# Altium project projet_pcb_etu.PrjPCB
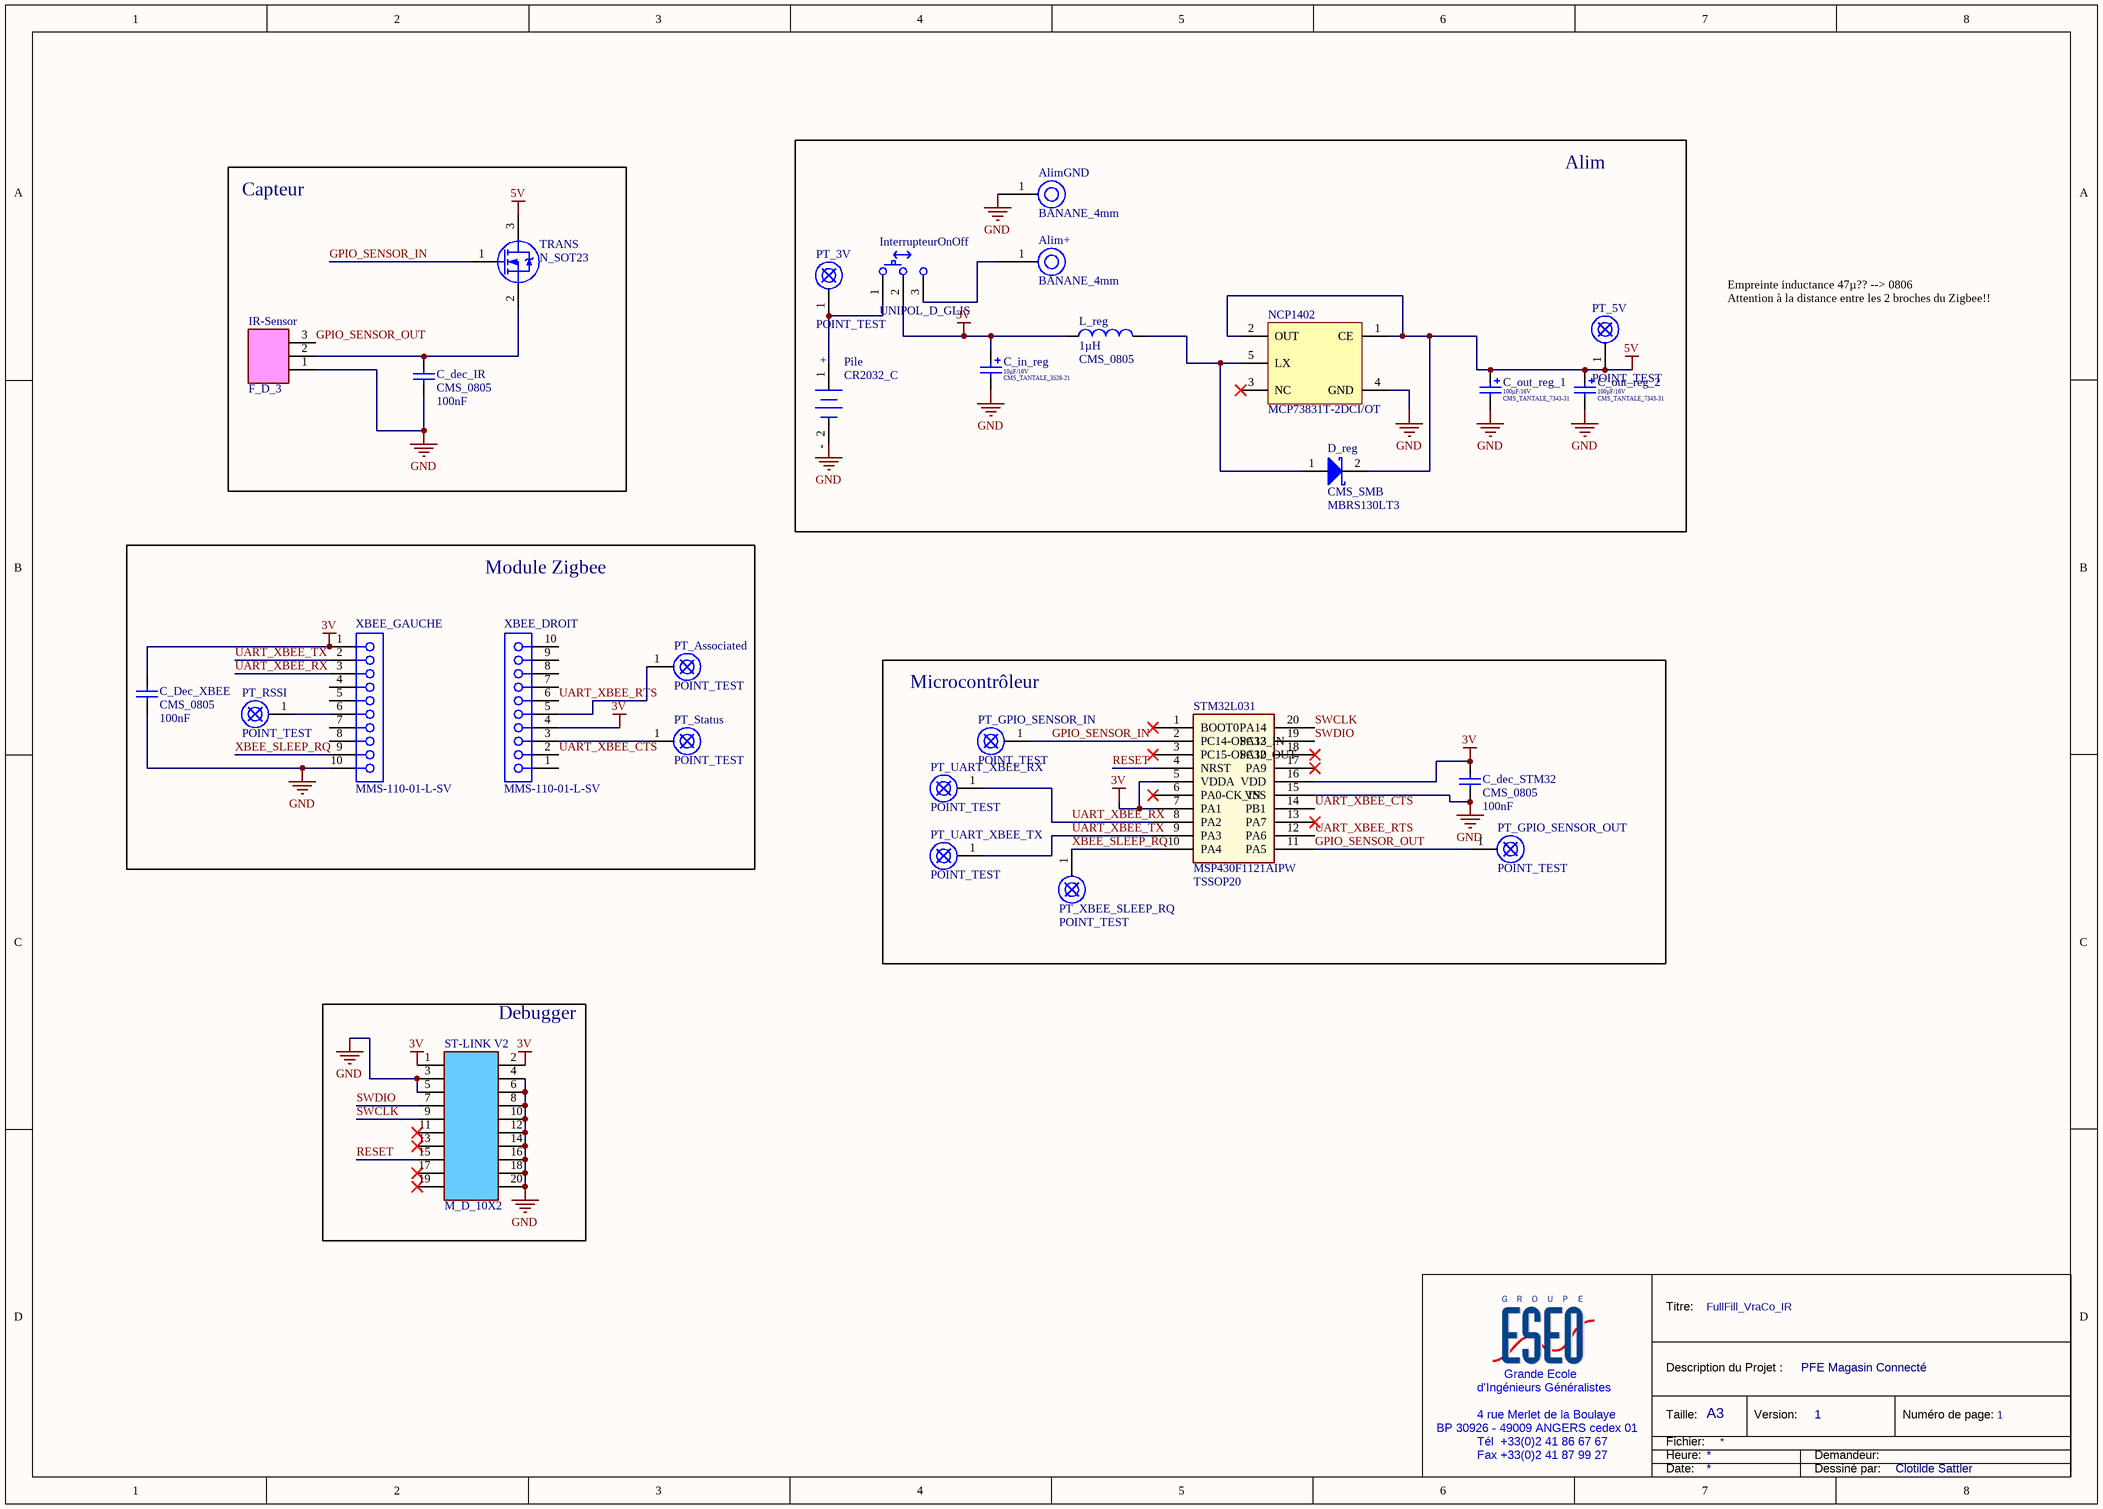
[diagram p0: projet_pcb_etu_formatA3.SchDoc]
1 sheet, 29 parts. Net scope: global (net labels, ports and power ports of the same name join across sheets).
Board file: projet_pcb_etu.PCBDOC

## Sheet projet_pcb_etu_formatA3.SchDoc
size A3

### Parts
Alim+  Type: BANANE_4mm  [DOUILLE_BANANE_4mm]  (hidden comment: DOUILLE BANANE 4mm)
AlimGND  Type: BANANE_4mm  [DOUILLE_BANANE_4mm]  (hidden comment: DOUILLE BANANE 4mm)
C_dec_IR  value 100nF  [CONDENSATEUR_CMS_0805]  (hidden comment: CMS_0805)
C_dec_STM32  value 100nF  [CONDENSATEUR_CMS_0805]  (hidden comment: CMS_0805)
C_Dec_XBEE  value 100nF  [CONDENSATEUR_CMS_0805]  (hidden comment: CMS_0805)
C_in_reg  value 10µF/16V  Type: CMS_TANTALE_3528-21  [CONDENSATEUR_CMS_POLARISE_TANTALE_B/3528-21]  (hidden comment: CMS_POLARISE_TANTALE_3528-21)
C_out_reg_1  value 100µF/16V  Type: CMS_TANTALE_7343-31  [CONDENSATEUR_CMS_POLARISE_TANTALE_D/7343-31]  (hidden comment: CMS_POLARISE_TANTALE_7343-31)
C_out_reg_2  value 100µF/16V  Type: CMS_TANTALE_7343-31  [CONDENSATEUR_CMS_POLARISE_TANTALE_D/7343-31]  (hidden comment: CMS_POLARISE_TANTALE_7343-31)
D_reg  Package: CMS_SMB  Type: MBRS130LT3  [DIODE_CMS_SMB]  (hidden comment: DIODE_CMS_SCHOTTKY_SMB : MBRS130LT3)
InterrupteurOnOff  Type: UNIPOL_D_GLIS  [INTER_UNIPOL_DROIT_GLISS]  (hidden comment: INTERRUPTEUR_UNIPOLAIRE_DROIT_GLISSIERE)
IR-Sensor  Type: F_D_3  [BARRETTE_3_F_D]  (hidden comment: BARRETTE 3 CONTACTS 1 RANGEE FEMELLE DROITE)
L_reg  value 1µH  Type: CMS_0805  [INDUCTANCE_CMS_0805]  (hidden comment: INDUCTANCE_CMS_0805)
NCP1402  MCP73831T-2DCI/OT  [SOT-23-OT5_N]
Pile  Type: CR2032_C  [PILE_CR2032_HORIZ]  (hidden comment: PILE_CR2032_COUDEE)
PT_3V  POINT_TEST  [POINT_TEST]
PT_5V  POINT_TEST  [POINT_TEST]
PT_Associated  POINT_TEST  [POINT_TEST]
PT_GPIO_SENSOR_IN  POINT_TEST  [POINT_TEST]
PT_GPIO_SENSOR_OUT  POINT_TEST  [POINT_TEST]
PT_RSSI  POINT_TEST  [POINT_TEST]
PT_Status  POINT_TEST  [POINT_TEST]
PT_UART_XBEE_RX  POINT_TEST  [POINT_TEST]
PT_UART_XBEE_TX  POINT_TEST  [POINT_TEST]
PT_XBEE_SLEEP_RQ  POINT_TEST  [POINT_TEST]
ST-LINK_V2  Type: M_D_10X2  [BARRETTE_10X2_M_D]  (hidden comment: BARRETTE_10 CONTACTS_2 RANGEES_MALE_DROITE)
STM32L031  Type: MSP430F1121AIPW  Package: TSSOP20  [TSSOP20_PAS=0.65_LARG=6.4_LONG=6.5]  (hidden comment: MSP430F1121AIPW_TSSOP20)
TRANS  Package: N_SOT23  [TRANSISTOR_MOSFET-N_SOT23_GSD]  (hidden comment: TRANSISTOR_MOSFET-N_SOT23_GSD)
XBEE_DROIT  MMS-110-01-L-SV  [SMTC-MMS-110-01-X-SV]
XBEE_GAUCHE  MMS-110-01-L-SV  [SMTC-MMS-110-01-X-SV]

### Blocks framed on the sheet
Capteur: C_dec_IR IR-Sensor TRANS
Alim: Alim+ AlimGND C_in_reg C_out_reg_1 C_out_reg_2 D_reg InterrupteurOnOff L_reg NCP1402 Pile PT_3V PT_5V
Module Zigbee: C_Dec_XBEE PT_Associated PT_RSSI PT_Status XBEE_DROIT XBEE_GAUCHE
Microcontrôleur: C_dec_STM32 PT_GPIO_SENSOR_IN PT_GPIO_SENSOR_OUT PT_UART_XBEE_RX PT_UART_XBEE_TX PT_XBEE_SLEEP_RQ STM32L031
Debugger: ST-LINK_V2

### Nets
3V: C_dec_STM32.2 C_Dec_XBEE.2 C_in_reg.1 InterrupteurOnOff.2 L_reg.1 ST-LINK_V2.1 ST-LINK_V2.2 STM32L031.5(VDDA) STM32L031.7(PA1) STM32L031.16(VDD) XBEE_DROIT.4 XBEE_GAUCHE.1
5V: C_out_reg_1.1 C_out_reg_2.1 D_reg.2 NCP1402.1(CE) NCP1402.2(OUT) PT_5V.1 TRANS.3(D)
GND: AlimGND.1 C_dec_IR.1 C_dec_STM32.1 C_Dec_XBEE.1 C_in_reg.2 C_out_reg_1.2 C_out_reg_2.2 IR-Sensor.1(GND) NCP1402.4(GND) Pile.2(-) ST-LINK_V2.3 ST-LINK_V2.4 ST-LINK_V2.5 ST-LINK_V2.6 ST-LINK_V2.8 ST-LINK_V2.10 ST-LINK_V2.12 ST-LINK_V2.14 ST-LINK_V2.16 ST-LINK_V2.18 ST-LINK_V2.20 STM32L031.15(VSS) XBEE_GAUCHE.10
GPIO_SENSOR_IN: PT_GPIO_SENSOR_IN.1 STM32L031.2(PC14-OSC32_IN) TRANS.1(G)
GPIO_SENSOR_OUT: IR-Sensor.3(OUT) PT_GPIO_SENSOR_OUT.1 STM32L031.11(PA5)
RESET: ST-LINK_V2.15 STM32L031.4(NRST)
SWCLK: ST-LINK_V2.9 STM32L031.20(PA14)
SWDIO: ST-LINK_V2.7 STM32L031.19(PA13)
UART_XBEE_CTS: STM32L031.14(PB1) XBEE_DROIT.2
UART_XBEE_RTS: STM32L031.12(PA6) XBEE_DROIT.6
UART_XBEE_RX: PT_UART_XBEE_RX.1 STM32L031.8(PA2) XBEE_GAUCHE.3
UART_XBEE_TX: PT_UART_XBEE_TX.1 STM32L031.9(PA3) XBEE_GAUCHE.2
XBEE_SLEEP_RQ: PT_XBEE_SLEEP_RQ.1 STM32L031.10(PA4) XBEE_GAUCHE.9
NetAlim+_1: Alim+.1 InterrupteurOnOff.3
NetC_dec_IR_2: C_dec_IR.2 IR-Sensor.2(VCC) TRANS.2(S)
NetD_reg_1: D_reg.1 L_reg.2 NCP1402.5(LX)
NetInterrupteurOnOff_1: InterrupteurOnOff.1 Pile.1(+) PT_3V.1
NetPT_Associated_1: PT_Associated.1 XBEE_DROIT.5
NetPT_RSSI_1: PT_RSSI.1 XBEE_GAUCHE.6
NetPT_Status_1: PT_Status.1 XBEE_DROIT.3

Not connected (* = marked no-connect by the designer): NCP1402 3(NC)*; ST-LINK_V2 11* 13* 17* 19*; STM32L031 1(BOOT0)* 3(PC15-OSC32_OUT)* 6(PA0-CK_IN)* 13(PA7)* 17(PA9)* 18(PA10)*; XBEE_DROIT 1(11) 7(17) 8(18) 9(19) 10(20); XBEE_GAUCHE 4 5 7 8

### Notes on the sheet
- Empreinte inductance 47µ?? --> 0806
  Attention à la distance entre les 2 broches du Zigbee!!
- Titre:
- FullFill_VraCo_IR
- d'Ingénieurs Généralistes
- Grande Ecole
- Description du Projet :
- PFE Magasin Connecté
- BP 30926 - 49009 ANGERS cedex 01
- 4 rue Merlet de la Boulaye
- Tél  +33(0)2 41 86 67 67
- Fax +33(0)2 41 87 99 27
- Taille:
- Heure:
- Fichier:
- A3
- Version:
- 1
- Demandeur:
- Numéro de page:
- Date:
- Dessiné par:
- Clotilde Sattler

### Library data of the parts
Alim+ AlimGND = DOUILLE_BANANE_4mm: DOUILLE BANANE 4 mm
C_dec_IR C_dec_STM32 C_Dec_XBEE = CONDENSATEUR_CMS_CER_0805: CONDENSATEUR CMS CERAMIQUE 0805; Type: CMS_0805
C_in_reg = CONDENSATEUR_CMS_POL_TANT_B_3528-21: CONDENSATEUR CMS POLARISE TANTALE BOITIER B/3528-21
C_out_reg_1 C_out_reg_2 = CONDENSATEUR_CMS_POL_TANT_D_7343-31: CONDENSATEUR CMS POLARISE TANTALE BOITIER D/7343-31
D_reg = DIODE_CMS_SCHOTTKY_SMB : MBRS130LT3: DIODE CMS SCHOTTKY SMB : MBRS130LT3
InterrupteurOnOff = INTERRUPTEUR_UNIPOLAIRE_DROIT_GLISSIERE: INTERRUPTEUR UNIPOLAIRE DROIT A GLISSIERE
IR-Sensor = BARRETTE_3 CONTACTS_1 RANGEE_FEMELLE_DROITE
L_reg = INDUCTANCE_CMS_0805: INDUCTANCE CMS 0805
NCP1402 = MCP73831T-2DCI/OT: Miniature Single-Cell, Fully Integrated Li-Ion, Li-Polymer Charge Management Controller, 4.2V, 5-Pin SOT-23, Industrial Temperature, Tape and Reel; Manufacturer: Microchip; DatasheetVersion: revE, Sep-2008; PackageVersion: revBB, Aug-2009; PackageReference: SOT-23-OT5; PackageDescription: 5-Lead Plastic Small Outline Transistor (OT) [SOT-23]; Supplier 1: Digi-Key; Supplier Part Number 1: MCP73831T-2DCI/OTTR-ND; Supplier 2: Digi-Key; Supplier Part Number 2: MCP73831T-2DCI/OTCT-ND; Supplier 3: Digi-Key; Supplier Part Number 3: MCP73831T-2DCI/OTDKR-ND; Supplier 4: Farnell; Supplier Part Number 4: 1840935; Supplier 5: Newark; Supplier Part Number 5: 84R6271; Supplier 6: Mouser; Supplier Part Number 6: 579-MCP73831T-2DCIOT; Mounting Technology: Surface Mount; Code_IPC: SOT23-5; PartNumber: MCP73831T-2DCI/OT; ComponentLink1Description: Manufacturer URL; ComponentLink1URL: http://www.microchip.com/; ComponentLink2Description: Datasheet; ComponentLink2URL: http://ww1.microchip.com/downloads/en/DeviceDoc/21984e.pdf; ComponentLink3Description: Package Specification; ComponentLink3URL: http://www.microchip.com/stellent/groups/techpub_sg/documents/packagingspec/en012702.pdf
Pile = PILE_LITHIUM_CR2032_COUDEE_1: PILE AU LITHIUM TYPE CR2032 COUDEE
PT_3V PT_5V PT_Associated PT_GPIO_SENSOR_IN PT_GPIO_SENSOR_OUT PT_RSSI PT_Status PT_UART_XBEE_RX PT_UART_XBEE_TX PT_XBEE_SLEEP_RQ = POINT_TEST: POINT TEST
STM32L031 = MSP430F1121AIPW_TSSOP20: MICROCONTROLEUR FLASH - 16BITS - TSSOP20
TRANS = TRANSISTOR_MOSFET-N_SOT23_GSD: TRANSISTOR MOSFET CANAL N BOITIER SOT23_GSD
XBEE_DROIT XBEE_GAUCHE = MMS-110-01-L-SV: Tiger Claw(TM) Socket Strip, Through-hole, Vertical, -55 to 125 degC, 2 mm Pitch, 10-Pin, Female, RoHS; Manufacturer: Samtec; Pitch: 2 mm; DatasheetVersion: F-214; PackageVersion: AO, 2/1993; PackageReference: MMS-110-01-X-SV; PackageDescription: 2mm Through Hole Box Connector Strip Assembly; Supplier 1: Digi-Key; Supplier Part Number 1: SAM1230-10-ND; Supplier 2: Farnell; Supplier Part Number 2: 1885919; Supplier 3: Newark; Supplier Part Number 3: 41T0710; Supplier 4: Newark; Supplier Part Number 4: 96M0485; Orientation: Vertical; RoHS: True; Temperature Range: -55 to 125 degC; Mounting Technology: Through-hole; PartNumber: MMS-110-01-L-SV; ComponentLink1Description: Manufacturer URL; ComponentLink1URL: http://www.samtec.com; ComponentLink2Description: Datasheet; ComponentLink2URL: http://www.samtec.com/documents/webfiles/pdf/MMS.PDF; ComponentLink3Description: Package Specification; ComponentLink3URL: http://www.samtec.com/documents/webfiles/cpdf/MMS-1XX-01-XXX-XX-XXX-MKT1.pdf